# Altium schematic sheet FSR.SchDoc: Arm - Claw Sensor
size Letter; DrawnBy: N. Chapman, A. Ebrahim, K.Hong; Organization: UW Robotics; Address1: 200 University Avenue; Address2: Waterloo; Address3: Ontario; Address4: Canada N2L 3G6; SheetNumber: 7; SheetTotal: 9
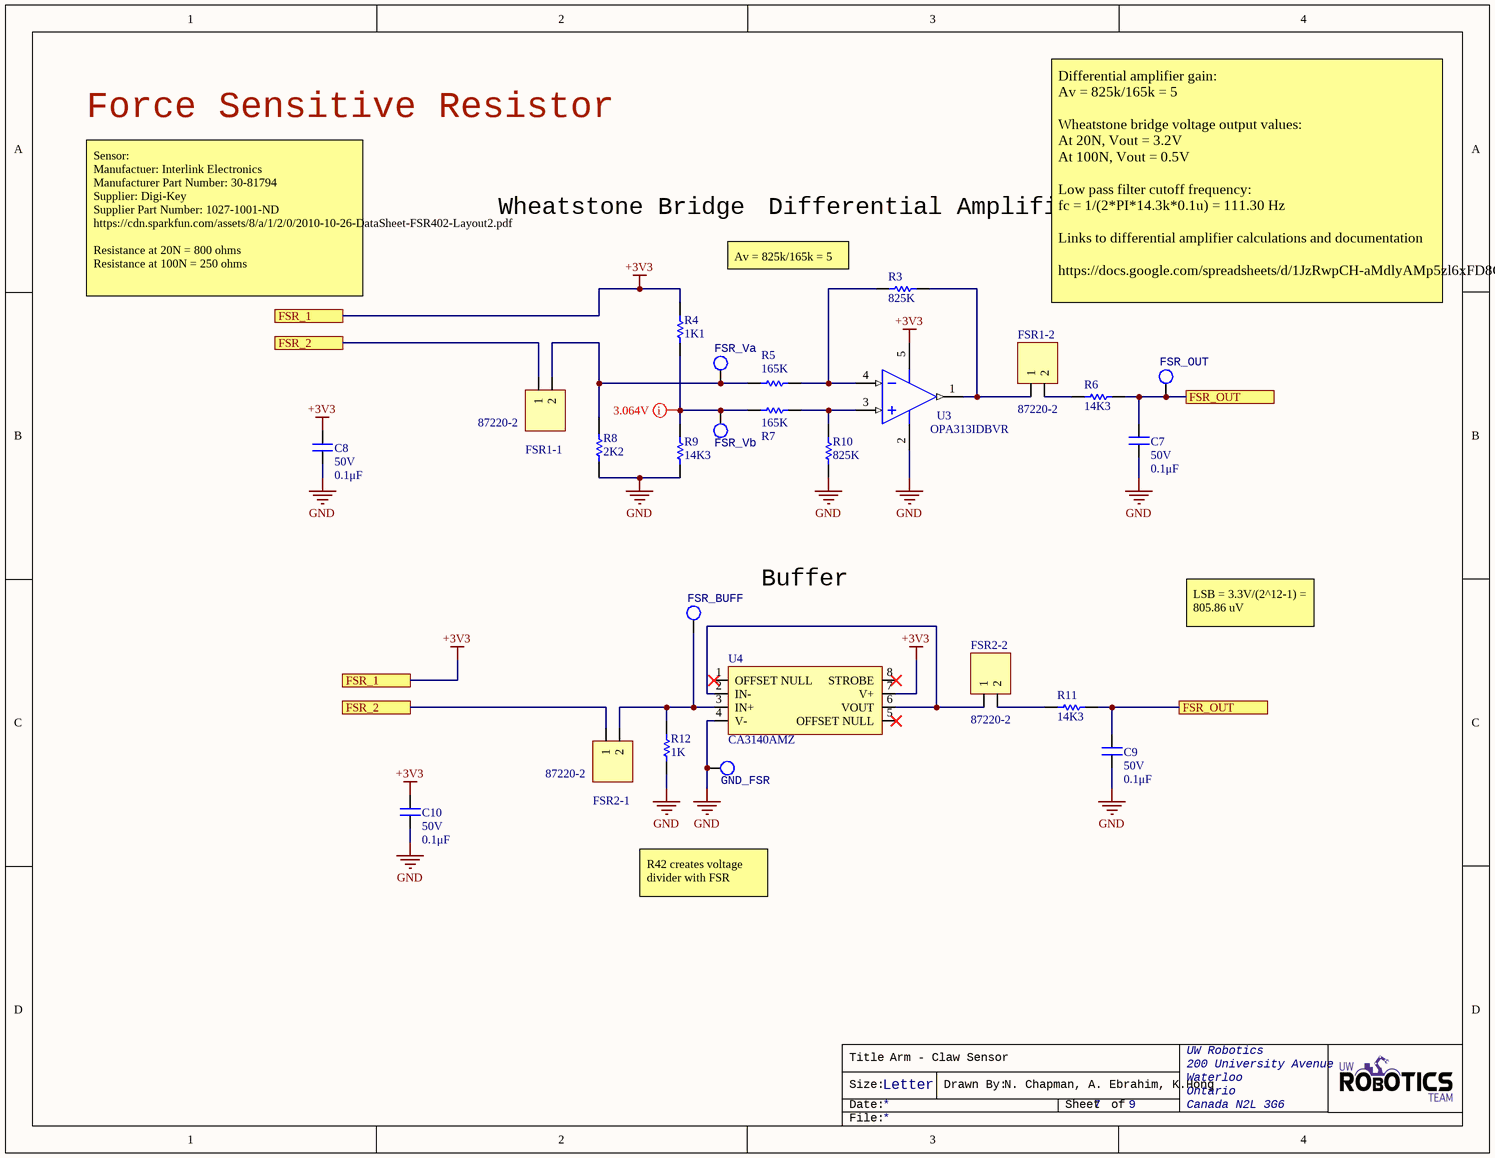
[diagram p0: FSR.SchDoc]

## Parts
C7  value 0.1μF  Voltage Rating: 50V  [CAPC0603(1608)55_N]  (hidden comment: CAP_0.1uF_50V_0603)
C8  value 0.1μF  Voltage Rating: 50V  [CAPC0603(1608)55_N]  (hidden comment: CAP_0.1uF_50V_0603)
C9  value 0.1μF  Voltage Rating: 50V  [CAPC0603(1608)55_N]  (hidden comment: CAP_0.1uF_50V_0603)
C10  value 0.1μF  Voltage Rating: 50V  [CAPC0603(1608)55_N]  (hidden comment: CAP_0.1uF_50V_0603)
FSR1-1  Manufacturer Part Number 1: 87220-2  [HDR1X2]  (hidden comment: JUMPER_2)
FSR1-2  Manufacturer Part Number 1: 87220-2  [HDR1X2]  (hidden comment: JUMPER_2)
FSR2-1  Manufacturer Part Number 1: 87220-2  [HDR1X2]  (hidden comment: JUMPER_2)
FSR2-2  Manufacturer Part Number 1: 87220-2  [HDR1X2]  (hidden comment: JUMPER_2)
FSR_BUFF  TESTPOINT_LOOP  [TESTPOINT_LOOP]  (value not drawn)
FSR_OUT  TESTPOINT_LOOP  [TESTPOINT_LOOP]  (value not drawn)
FSR_Va  TESTPOINT_LOOP  [TESTPOINT_LOOP]  (value not drawn)
FSR_Vb  TESTPOINT_LOOP  [TESTPOINT_LOOP]  (value not drawn)
GND_FSR  TESTPOINT_LOOP  [TESTPOINT_LOOP]  (value not drawn)
R3  value 825K  [RESC0603(1608)_N]  (hidden comment: RES_825K_0603)
R4  value 1K1  [RESC0603(1608)_N]  (hidden comment: 1.1K 1%)
R5  value 165K  [RESC0603(1608)_N]  (hidden comment: RES_165K_0603)
R6  value 14K3  [RESC0603(1608)_N]  (hidden comment: RES_14K3_0603)
R7  value 165K  [RESC0603(1608)_N]  (hidden comment: RES_165K_0603)
R8  value 2K2  [RESC0603(1608)_N]  (hidden comment: RES_2K2_0603)
R9  value 14K3  [RESC0603(1608)_N]  (hidden comment: 14.3K 1%)
R10  value 825K  [RESC0603(1608)_N]  (hidden comment: RES_825K_0603)
R11  value 14K3  [RESC0603(1608)_N]  (hidden comment: RES_14K3_0603)
R12  value 1K  [RESC0603(1608)_N]  (hidden comment: RES_1K_0603)
U3  OPA313IDBVR  [DBV0005A_M]
U4  CA3140AMZ  [CA3140AMZ]

## Ports
FSR_1, FSR_2, FSR_OUT

## Nets
+3V3: C8.2 C10.2 R4.2 U3.5(V+) U4.7(V+) ; port FSR_1
GND: C7.1 C8.1 C9.1 C10.1 GND_FSR.1 R8.1 R9.1 R10.1 R12.1 U3.2(V-) U4.4(V-)
FSR_2: FSR1-1.1 FSR2-1.1 ; port FSR_2
FSR_OUT: C7.2 C9.2 FSR_OUT.1 R6.2 R11.2 ; port FSR_OUT
NetFSR1-1_2: FSR1-1.2 FSR_Va.1 R5.1 R8.2
NetFSR1-2_1: FSR1-2.1 R3.2 U3.1(OUT)
NetFSR1-2_2: FSR1-2.2 R6.1
NetFSR2-1_2: FSR2-1.2 FSR_BUFF.1 R12.2 U4.3(IN+)
NetFSR2-2_1: FSR2-2.1 U4.2(IN-) U4.6(VOUT)
NetFSR2-2_2: FSR2-2.2 R11.1
NetFSR_Vb_1: FSR_Vb.1 R4.1 R7.1 R9.2
NetR3_1: R3.1 R5.2 U3.4(IN-)
NetR7_2: R7.2 R10.2 U3.3(IN+)

Not connected (* = marked no-connect by the designer): U4 1(OFFSET_NULL)* 5(OFFSET_NULL)* 8(STROBE)*

## Layout directives
mark named 3.064V: NetFSR_Vb_1

## Notes on the sheet
- Force Sensitive Resistor
- Wheatstone Bridge
- Differential Amplifier
- Sensor:
  Manufactuer: Interlink Electronics
  Manufacturer Part Number: 30-81794
  Supplier: Digi-Key
  Supplier Part Number: 1027-1001-ND
  https://cdn.sparkfun.com/assets/8/a/1/2/0/2010-10-26-DataSheet-FSR402-Layout2.pdf
  Resistance at 20N = 800 ohms
  Resistance at 100N = 250 ohms
- Av = 825k/165k = 5
- Differential amplifier gain:
  Av = 825k/165k = 5
  Wheatstone bridge voltage output values:
  At 20N, Vout = 3.2V
  At 100N, Vout = 0.5V
  Low pass filter cutoff frequency:
  fc = 1/(2*PI*14.3k*0.1u) = 111.30 Hz
  Links to differential amplifier calculations and documentation
  https://docs.google.com/spreadsheets/d/1JzRwpCH-aMdlyAMp5zl6xFD8GIuJzvmOR8Y5Kzd1RN0/edit#gid=0
- Buffer
- LSB = 3.3V/(2^12-1) = 805.86 uV
- R42 creates voltage divider with FSR
- Title
- Size:
- Date:
- Letter
- Drawn By:
- Sheet
- of
- File:

## Library data of the parts
C7-C10 = CAP_0.1uF_50V_0603: CAP CER 0.1UF 50V X7R 0603; Manufacturer Part Number 1: CC0603KRX7R9BB104; Manufacturer 1: Yageo; Dimensions: 0.063" L x 0.031" W (1.60mm x 0.80mm); Package: 0603 (1608 Metric); Temperature Coefficient: X7R; Supplier Part Number 1: 311-1344-1-ND; Supplier 1: Digi-Key; Mount: Surface Mount; Case Code (Imperial): 0603; Case Code (Metric): 1608; Dielectric: X7R
FSR1-1 FSR1-2 FSR2-1 FSR2-2 = JUMPER_2: HEADER 2X1; Manufacturer 1: TE Connectivity; Supplier 1: Digi-Key; Supplier Part Number 1: A26542-ND; Mount: Through Hole
FSR_BUFF FSR_OUT FSR_Va FSR_Vb GND_FSR = TESTPOINT_LOOP: Loop testpoint through-hole pad; Manufacturer Part Number 1: 5002; Manufacturer 1: Keystone Electronics; Supplier Part Number 1: 36-5002-ND; Supplier 1: Digi-Key; Mount: Through Hole
R3 R10 = RES_825K_0603: RES SMD 825K OHM 1% 1/10W 0603; Manufacturer: Yageo; MPN: RC0603FR-07825KL; Package: 0603 (1608 Metric); Dimensions: 0.063" L x 0.031" W (1.60mm x 0.80mm); Tolerance: 1%; Supplier Part Number 1: 311-825KHRCT-ND; Supplier 1: Digi-Key
R4 = RES_1K1_0603: RES SMD 1.1K OHM 1% 1/10W 0603; Manufacturer: Yageo; MPN: RC0603FR-071K1L; Dimensions: 0.063" L x 0.031" W (1.60mm x 0.80mm); Tolerance: 1%; Package: 0603 (1608 Metric); Supplier Part Number 1: 311-1.10KHRCT-ND; Supplier 1: Digi-Key
R5 R7 = RES_165K_0603: RES SMD 165K OHM 1% 1/10W 0603; Manufacturer: Yageo; MPN: RC0603FR-07165KL; Package: 0603 (1608 Metric); Dimensions: 0.063" L x 0.031" W (1.60mm x 0.80mm); Tolerance: 1%; Supplier Part Number 1: 311-165KHRCT-ND; Supplier 1: Digi-Key
R6 R9 R11 = RES_14K3_0603: RES SMD 14.3K OHM 1% 1/10W 0603; Manufacturer: Yageo; MPN: RC0603FR-0714K3L; Package: 0603 (1608 Metric); Dimensions: 0.063" L x 0.031" W (1.60mm x 0.80mm); Tolerance: 1%; Supplier Part Number 1: 311-14.3KHRCT-ND; Supplier 1: Digi-Key
R8 = RES_2K2_0603: RES SMD 2.2K OHM 1% 1/10W 0603; Manufacturer: Yageo; MPN: RC0603FR-072K2L; Dimensions: 0.063" L x 0.031" W (1.60mm x 0.80mm); Package: 0603 (1608 Metric); Tolerance: 1%; Supplier Part Number 1: 311-2.20KHRCT-ND; Supplier 1: Digi-Key
R12 = RES_1K_0603: RES SMD 1K OHM 5% 1/10W 0603; Manufacturer: Yageo; MPN: RC0603JR-071KL; Dimensions: 0.063" L x 0.031" W (1.60mm x 0.80mm); Tolerance: 5%; Package: 0603 (1608 Metric); Supplier Part Number 1: 311-1.0KGRCT-ND; Supplier 1: Digi-Key
U3 = OPAMP: IC OPAMP GP 1 CIRCUIT SOT23-5; Manufacturer 1: Texas Instruments; Offset Drift(Typ)(uV/C): 2; Rating: Catalog; Packing: LARGE T&R; SubFamily: Low Input Bias Current Amp (<=10pA), Low Power Amp (<=500uA); Number of Channels: 1; Eco-Plan: Green (RoHS & no Sb/Br); Vio (25C)(Max)(mV): 2.5; Total Supply Voltage(Min)(+5V is 5, +/-5V is 10): 1.8; CMRR(Min)(dB): 70; Total Supply Voltage(Max)(+5V is 5, +/-5V is 10): 5.5; Iq per channel(Max)(mA): 0.06; Slew Rate(Typ)(V/us): 0.5; ComponentLink1Description: Manufacturer URL; PackageVersion: 4073253-4/K, 03/2006; ComponentLink2Description: Datasheet; Code_JEDEC: MO-178; GBW(Typ)(MHz): 1; ComponentLink3Description: Package Specification; PartNumber: OPA313IDBVR; PackageReference: DBV0005A; PackageDescription: 5-Pin Plastic Small Outline, Body 1.6 x 2.9 mm, Pitch 0.95 mm; ComponentLink1URL: http://www.ti.com/; DatasheetVersion: SBOS649C; ComponentLink2URL: http://www.ti.com/lit/ds/symlink/opa313.pdf; ComponentLink3URL: http://www.ti.com/litv/pdf/mpds018i; Supplier Part Number 1: 296-35607-1-ND; Supplier 1: Digi-Key; Mount: Surface Mount; Manufacturer Part Number 1: OPA313IDBVR
U4 = CA3140AMZ: IC OPAMP GP 1 CIRCUIT 8SOIC; Manufacturer 1: Renesas Electronics America Inc.; Supplier Part Number 1: CA3140AMZ-ND; Supplier 1: Digi-Key; Manufacturer Part Number 1: CA3140AMZ; Mount: Surface Mount